# Altium project Shield.PrjPcb
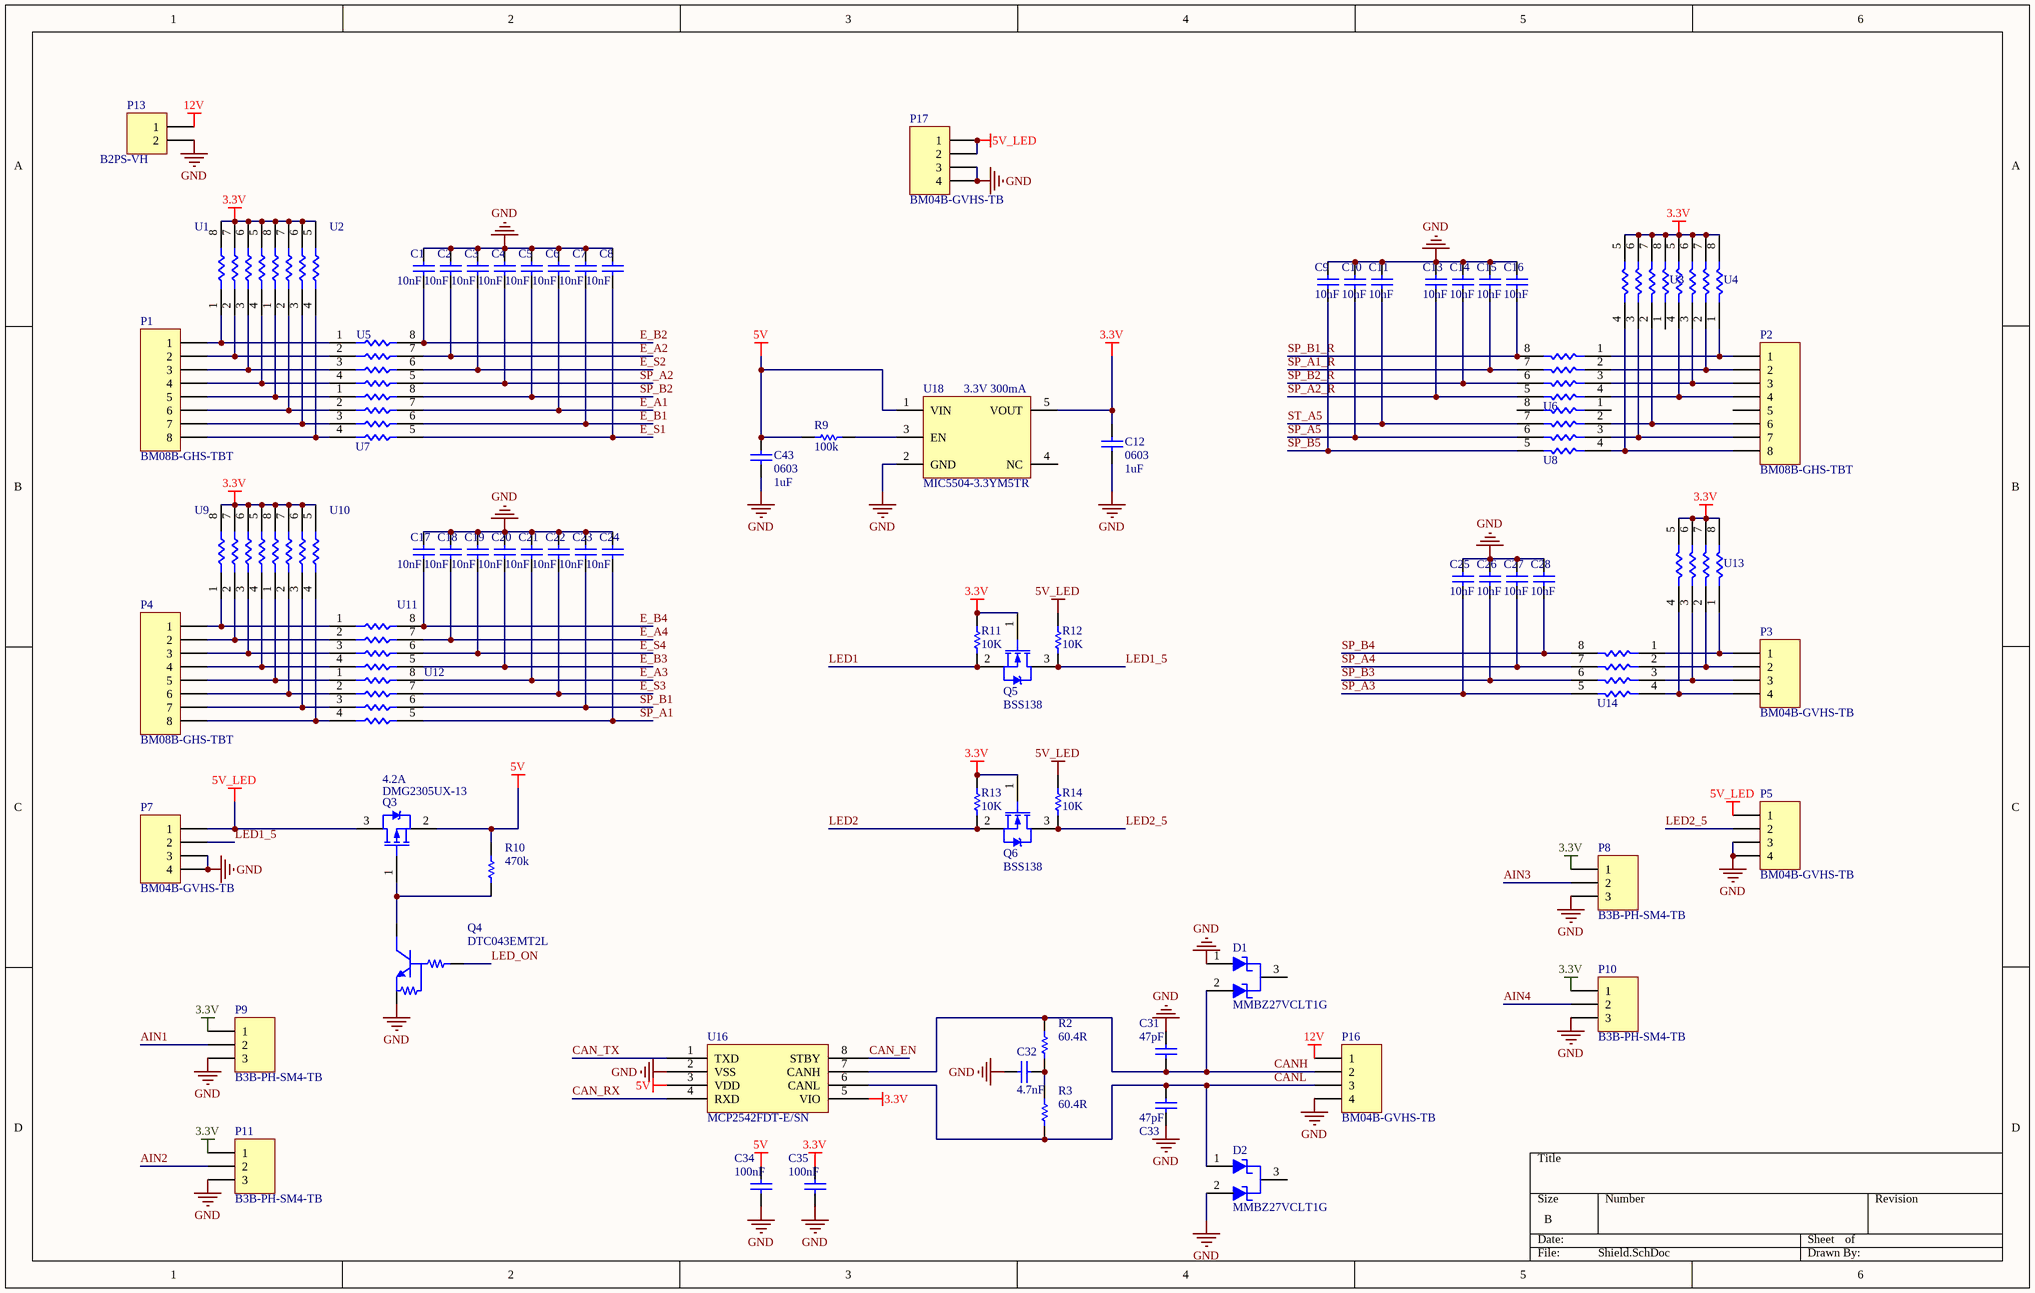
[diagram p0: Shield.SchDoc]
3 sheets, 103 parts. Net scope: global (net labels, ports and power ports of the same name join across sheets).
Board file: Shield.PcbDoc
Sheets:
  Shield.SchDoc
  SheildLattePanda.SchDoc
  STM32F103RCT6.SchDoc

## Sheet Shield.SchDoc
size B; SheetNumber: 1; SheetTotal: 3

### Parts
C1  10nF  [C0402]
C2  10nF  [C0402]
C3  10nF  [C0402]
C4  10nF  [C0402]
C5  10nF  [C0402]
C6  10nF  [C0402]
C7  10nF  [C0402]
C8  10nF  [C0402]
C9  10nF  [C0402]
C10  10nF  [C0402]
C11  10nF  [C0402]
C12  0603  value 1uF  [C0603]
C13  10nF  [C0402]
C14  10nF  [C0402]
C15  10nF  [C0402]
C16  10nF  [C0402]
C17  10nF  [C0402]
C18  10nF  [C0402]
C19  10nF  [C0402]
C20  10nF  [C0402]
C21  10nF  [C0402]
C22  10nF  [C0402]
C23  10nF  [C0402]
C24  10nF  [C0402]
C25  10nF  [C0402]
C26  10nF  [C0402]
C27  10nF  [C0402]
C28  10nF  [C0402]
C31  47pF  [C0402]
C32  4.7nF  [C0402]
C33  47pF  [C0402]
C34  100nF  [C0402]
C35  100nF  [C0402]
C43  0603  value 1uF  [C0603]
D1  MMBZ27VCLT1G  [SOT-23]
D2  MMBZ27VCLT1G  [SOT-23]
P1  BM08B-GHS-TBT  [CONN-BM08B-GHS-TBT]
P2  BM08B-GHS-TBT  [CONN-BM08B-GHS-TBT - INVERTED]
P3  BM04B-GVHS-TB  [CONN-SM04B-GHSV-TB - INVERTED]
P4  BM08B-GHS-TBT  [CONN-BM08B-GHS-TBT]
P5  BM04B-GVHS-TB  [CONN-SM04B-GHSV-TB - INVERTED]
P7  BM04B-GVHS-TB  [CONN-SM04B-GHSV-TB]
P8  B3B-PH-SM4-TB  [CONN-B3B-PH-SM4-TB]
P9  B3B-PH-SM4-TB  [CONN-B3B-PH-SM4-TB]
P10  B3B-PH-SM4-TB  [CONN-B3B-PH-SM4-TB]
P11  B3B-PH-SM4-TB  [CONN-B3B-PH-SM4-TB]
P13  B2PS-VH  [CONN-B2PS-VH]
P16  BM04B-GVHS-TB  [CONN-SM04B-GHSV-TB - INVERTED]
P17  BM04B-GVHS-TB  [CONN-SM04B-GHSV-TB - INVERTED]
Q3  DMG2305UX-13  Continuous Drain Current (ID): 4.2A  [SOT23-3]
Q4  DTC043EMT2L  [SOT-723]
Q5  BSS138  [SOT-23]
Q6  BSS138  [SOT-23]
R2  60.4R  [R0402]
R3  60.4R  [R0402]
R9  value 100k  [R0402]
R10  value 470k  [R0402]
R11  value 10K  [R0402]  (hidden comment: Res1)
R12  value 10K  [R0402]  (hidden comment: Res1)
R13  value 10K  [R0402]  (hidden comment: Res1)
R14  value 10K  [R0402]  (hidden comment: Res1)
U1  CAY16-1002F4LF  [RES_ARRAY_4]  (value not drawn)
U2  CAY16-1002F4LF  [RES_ARRAY_4]  (value not drawn)
U3  CAY16-1002F4LF  [RES_ARRAY_4 - INVERTED]  (value not drawn)
U4  CAY16-1002F4LF  [RES_ARRAY_4 - INVERTED]  (value not drawn)
U5  CAY16-1002F4LF  [RES_ARRAY_4 - INVERTED]  (value not drawn)
U6  CAY16-1002F4LF  [RES_ARRAY_4]  (value not drawn)
U7  CAY16-1002F4LF  [RES_ARRAY_4 - INVERTED]  (value not drawn)
U8  CAY16-1002F4LF  [RES_ARRAY_4]  (value not drawn)
U9  CAY16-1002F4LF  [RES_ARRAY_4]  (value not drawn)
U10  CAY16-1002F4LF  [RES_ARRAY_4]  (value not drawn)
U11  CAY16-1002F4LF  [RES_ARRAY_4 - INVERTED]  (value not drawn)
U12  CAY16-1002F4LF  [RES_ARRAY_4 - INVERTED]  (value not drawn)
U13  CAY16-1002F4LF  [RES_ARRAY_4]  (value not drawn)
U14  CAY16-1002F4LF  [RES_ARRAY_4]  (value not drawn)
U16  MCP2542FDT-E/SN  [SOIC-8(150MIL)]
U18  MIC5504-3.3YM5TR  value 3.3V 300mA  [SOT23-5]

### Nets
3.3V: C12.2 C35.2 P8.1 P9.1 P10.1 P11.1 Q5.1(G) Q6.1(G) R11.1 R13.1 U1.5 U1.6 U1.7 U1.8 U2.5 U2.6 U2.7 U2.8 U3.5 U3.6 U3.7 U3.8 U4.5 U4.6 U4.7 U4.8 U9.5 U9.6 U9.7 U9.8 U10.5 U10.6 U10.7 U10.8 U13.5 U13.6 U13.7 U13.8 U16.5(VIO) U18.5(VOUT)
5V: C34.2 C43.2 Q3.2(S) R9.1 R10.2 U16.3(VDD) U18.1(VIN)
5V_LED: P5.1 P7.1 P17.1 P17.2 Q3.3(D) R12.1 R14.1
12V: P13.1 P16.1
GND: C1.2 C2.2 C3.2 C4.2 C5.2 C6.2 C7.2 C8.2 C9.2 C10.2 C11.2 C12.1 C13.2 C14.2 C15.2 C16.2 C17.2 C18.2 C19.2 C20.2 C21.2 C22.2 C23.2 C24.2 C25.2 C26.2 C27.2 C28.2 C31.2 C32.2 C33.1 C34.1 C35.1 C43.1 D1.1 D2.2(C) P5.3 P5.4 P7.3 P7.4 P8.3 P9.3 P10.3 P11.3 P13.2 P16.4 P17.3 P17.4 Q4.2(E) U16.2(VSS) U18.2(GND)
AIN1: P9.2
AIN2: P11.2
AIN3: P8.2
AIN4: P10.2
CAN_EN: U16.8(STBY)
CAN_RX: U16.4(RXD)
CAN_TX: U16.1(TXD)
CANH: C31.1 D1.2(C) P16.2 R2.2 U16.7(CANH)
CANL: C33.2 D2.1 P16.3 R3.1 U16.6(CANL)
E_A1: C6.1 U7.7
E_A2: C2.1 U5.7
E_A3: C21.1 U12.8
E_A4: C18.1 U11.7
E_B1: C7.1 U7.6
E_B2: C1.1 U5.8
E_B3: C20.1 U11.5
E_B4: C17.1 U11.8
E_S1: C8.1 U7.5
E_S2: C3.1 U5.6
E_S3: C22.1 U12.7
E_S4: C19.1 U11.6
LED1: Q5.2(S) R11.2
LED1_5: P7.2 Q5.3(D) R12.2
LED2: Q6.2(S) R13.2
LED2_5: P5.2 Q6.3(D) R14.2
LED_ON: Q4.1(B)
SP_A1: C24.1 U12.5
SP_A1_R: C15.1 U6.7
SP_A2: C4.1 U5.5
SP_A2_R: C13.1 U6.5
SP_A3: C25.1 U14.5
SP_A4: C27.1 U14.7
SP_A5: C10.1 U8.6
SP_B1: C23.1 U12.6
SP_B1_R: C16.1 U6.8
SP_B2: C5.1 U7.8
SP_B2_R: C14.1 U6.6
SP_B3: C26.1 U14.6
SP_B4: C28.1 U14.8
SP_B5: C9.1 U8.5
ST_A5: C11.1 U8.7
NetC32_1: C32.1 R2.1 R3.2
NetP1_1: P1.1 U1.1 U5.1
NetP1_2: P1.2 U1.2 U5.2
NetP1_3: P1.3 U1.3 U5.3
NetP1_4: P1.4 U1.4 U5.4
NetP1_5: P1.5 U2.1 U7.1
NetP1_6: P1.6 U2.2 U7.2
NetP1_7: P1.7 U2.3 U7.3
NetP1_8: P1.8 U2.4 U7.4
NetP2_1: P2.1 U4.1 U6.1
NetP2_2: P2.2 U4.2 U6.2
NetP2_3: P2.3 U4.3 U6.3
NetP2_4: P2.4 U4.4 U6.4
NetP2_6: P2.6 U3.2 U8.2
NetP2_7: P2.7 U3.3 U8.3
NetP2_8: P2.8 U3.4 U8.4
NetP3_1: P3.1 U13.1 U14.1
NetP3_2: P3.2 U13.2 U14.2
NetP3_3: P3.3 U13.3 U14.3
NetP3_4: P3.4 U13.4 U14.4
NetP4_1: P4.1 U9.1 U11.1
NetP4_2: P4.2 U9.2 U11.2
NetP4_3: P4.3 U9.3 U11.3
NetP4_4: P4.4 U9.4 U11.4
NetP4_5: P4.5 U10.1 U12.1
NetP4_6: P4.6 U10.2 U12.2
NetP4_7: P4.7 U10.3 U12.3
NetP4_8: P4.8 U10.4 U12.4
NetQ3_1: Q3.1(G) Q4.3(C) R10.1
NetR9_2: R9.2 U18.3(EN)

Not connected (* = marked no-connect by the designer): D1 3(K); D2 3(K); P2 5; U3 1; U8 1 8; U18 4(NC)

### Library data of the parts
C1-C11 C13-C28 = Cap: Multilayer Ceramic Capacitor, 0.01 uF, 16 V, ± 5%, C0G (NP0), 0402 [1005 Metric]; Manufacturer: Yageo; Manufacturer Part Number: CC0402KRX7R7BB103; Voltage Rating: 16V; Tolerance: 10%; Dielectric: X7R; Insulation Resistance: 10GR; Dissipation Factor: 3.5%; Supplier 1: Digi-Key; Supplier Part Number 1: 311-1042-1-ND; RoHS: Yes; Category: Ceramic Capacitors; Stock 1: 2573957; Pricing 1: 1=0.1, 10=0.016, 50=0.0088, 100=0.0071, 500=0.0051, 1000=0.004, 2500=0.00364, 5000=0.00335 (USD); Mount: Surface Mount; Case/Package: 0402; Number of Pins: 2; Case Code (Metric): 1005; Case Code (Imperial): 0402; Min Operating Temperature: -55°C; Max Operating Temperature: 125°C; Capacitance: 10nF; Packaging: Tape and Reel; Series: CC; Voltage Rating (DC): 16V; Termination: SMD/SMT; Package Quantity: 1; Length: 1mm; Width: 0.02inch; Height: 0.5mm; Depth: 0.5mm; Thickness: 0.022inch; Radiation Hardening: No; RoHS Compliant: Yes; Reach SVHC Compliant: No; Lead Free: Lead Free; Halogen Free: Halogen Free; ComponentLink1URL: https://datasheet.ciiva.com/143/mlccorderingcode-143951.pdf?src-supplier=Digi-Key; ComponentLink1Description: https://datasheet.ciiva.com/143/mlccorderingcode-143951.pdf?src-supplier=Digi-Key; ComponentLink2URL: https://datasheet.ciiva.com/143/mlccorderingcode-143950.pdf?src-supplier=Digi-Key; ComponentLink2Description: https://datasheet.ciiva.com/143/mlccorderingcode-143950.pdf?src-supplier=Digi-Key; ComponentLink3URL: https://datasheet.ciiva.com/143/upy-gphc-x7r-6-3v-to-50v-8-143952.pdf?src-supplier=Digi-Key; ComponentLink3Description: https://datasheet.ciiva.com/143/upy-gphc-x7r-6-3v-to-50v-8-143952.pdf?src-supplier=Digi-Key; ComponentLink4URL: https://datasheet.ciiva.com/8033/70765-8033655.pdf?src-supplier=Element14; ComponentLink4Description: https://datasheet.ciiva.com/8033/70765-8033655.pdf?src-supplier=Element14; ComponentLink5URL: https://datasheet.ciiva.com/7978/1489800-7978109.pdf?src-supplier=Element14; ComponentLink5Description: https://datasheet.ciiva.com/7978/1489800-7978109.pdf?src-supplier=Element14; ComponentLink6URL: https://datasheet.ciiva.com/28450/1489800-28450330.pdf?src-supplier=Element14; ComponentLink6Description: https://datasheet.ciiva.com/28450/1489800-28450330.pdf?src-supplier=Element14; ComponentLink7URL: https://datasheet.ciiva.com/8033/1489800-8033659.pdf?src-supplier=Element14; ComponentLink7Description: https://datasheet.ciiva.com/8033/1489800-8033659.pdf?src-supplier=Element14; ComponentLink8URL: https://datasheet.ciiva.com/8033/1489800-8033658.pdf?src-supplier=Element14; ComponentLink8Description: https://datasheet.ciiva.com/8033/1489800-8033658.pdf?src-supplier=Element14; ComponentLink9URL: https://datasheet.ciiva.com/5425/upy-gp-np0-16v-to-50v-8-3714-5425438.pdf?src-supplier=Mouser; ComponentLink9Description: https://datasheet.ciiva.com/5425/upy-gp-np0-16v-to-50v-8-3714-5425438.pdf?src-supplier=Mouser
C12 C43 = Cap: Capacitor; Published: 8-Jun-2000; LatestRevisionDate: 17-Jul-2002; LatestRevisionNote: Re-released for DXP Platform.; PackageReference: RAD-0.3; Publisher: Altium Limited; PackageDescription: Radial Cap, Thru-Hole; 2 Leads; 0.3 in Pin Spacing
C31 C33 = Cap: Cap Cer 47PF 100V C0G/NP0 0402; Manufacturer: Wurth Electronics; Manufacturer Part Number: 885012005078; Tolerance: 5%; Supplier 1: Digi-Key; Supplier Part Number 1: 732-12071-1-ND; RoHS: Yes; Category: Ceramic Capacitors; Stock 1: 57686; Pricing 1: 1=0.1, 10=0.039, 100=0.035, 500=0.031 (USD); Mount: Surface Mount; Case/Package: 0402; Case Code (Imperial): 0402; Case Code (Metric): 1005; Min Operating Temperature: -55°C; Max Operating Temperature: 125°C; Packaging: Cut Tape; Capacitance: 47pF; Series: WCAP-CSGP; Voltage Rating: 100V; ComponentLink1URL: http://www.farnell.com/datasheets/2546566.pdf?src-supplier=Farnell; ComponentLink1Description: http://www.farnell.com/datasheets/2546566.pdf?src-supplier=Farnell; ComponentLink2URL: https://katalog.we-online.de/pbs/datasheet/885012005078.pdf?src-supplier=Digi-Key; ComponentLink2Description: https://katalog.we-online.de/pbs/datasheet/885012005078.pdf?src-supplier=Digi-Key; ComponentLink3URL: http://www.farnell.com/datasheets/2546566.pdf?src-supplier=Newark; ComponentLink3Description: http://www.farnell.com/datasheets/2546566.pdf?src-supplier=Newark
C32 = Cap: Cap Cer 4700PF 100V X7R 0402; Manufacturer: Wurth Electronics; Manufacturer Part Number: 885012205084; Tolerance: 10%; Supplier 1: Digi-Key; Supplier Part Number 1: 732-12234-1-ND; RoHS: No; Category: Ceramic Capacitors; Stock 1: 14393; Pricing 1: 1=0.1, 10=0.039, 100=0.035, 500=0.031 (USD); Mount: Surface Mount; Case/Package: 0402; Case Code (Imperial): 0402; Case Code (Metric): 1005; Min Operating Temperature: -55°C; Max Operating Temperature: 125°C; Packaging: Cut Tape; Capacitance: 4.7nF; Series: WCAP-CSGP; Voltage Rating: 100V; ComponentLink1URL: http://www.farnell.com/datasheets/2546792.pdf?src-supplier=Farnell; ComponentLink1Description: http://www.farnell.com/datasheets/2546792.pdf?src-supplier=Farnell; ComponentLink2URL: https://katalog.we-online.de/pbs/datasheet/885012205084.pdf?src-supplier=Digi-Key; ComponentLink2Description: https://katalog.we-online.de/pbs/datasheet/885012205084.pdf?src-supplier=Digi-Key; ComponentLink3URL: http://www.farnell.com/datasheets/2546792.pdf?src-supplier=Newark; ComponentLink3Description: http://www.farnell.com/datasheets/2546792.pdf?src-supplier=Newark; ComponentLink4URL: http://www.farnell.com/datasheets/2546792.pdf?src-supplier=Element14; ComponentLink4Description: http://www.farnell.com/datasheets/2546792.pdf?src-supplier=Element14
C34 C35 = Cap: 100nF ±10% 16V X7R 0402 Multilayer Ceramic Capacitors MLCC - SMD/SMT RoHS; Manufacturer: KEMET; Manufacturer Part Number: C0402C104K4RAC-TU; Dissipation Factor: 3.5%; Supplier 1: Digi-Key; Supplier Part Number 1: 399-C0402C104K4RAC7867CT-ND; RoHS: Yes; Category: Ceramic Capacitors; Stock 1: 4665619; Pricing 1: 1=0.1, 10=0.032, 50=0.0172, 100=0.0141, 500=0.01008, 1000=0.00792, 2500=0.0072, 5000=0.00662 (USD); Case/Package: 0402; Number of Pins: 2; Case Code (Metric): 1005; Case Code (Imperial): 0402; Dielectric Material: Ceramic; Min Operating Temperature: -55°C; Max Operating Temperature: 125°C; Capacitance: 100nF; Tolerance: 10%; Voltage Rating: 16V; Packaging: Tape and Reel; Series: C; Dielectric: X7R; Voltage: 16V; Termination: SMD/SMT; Length: 1mm; Height: 0.5mm; Depth: 0.5mm; Reach SVHC Compliant: No
D1 D2 = MMBZ27VCLT1G: TVS DIODE 22VWM 38VC SOT23; Manufacturer: ON Semiconductor; Direction: Unidirectional,Bidirectional; Number of Elements: 2; Reverse Breakdown Voltage: 25.65V; Operating Supply Voltage: 22V; Max Surge Current: 1A; Polarity: Unidirectional; Clamping Voltage: 38V; Peak Pulse Power: 40W; Power Line Protection: No; Leakage Current: 50nA; Test Current: 1mA; ESD Protection: Yes; Diode Type: ZENER; Max Breakdown Voltage: 28.35V; Voltage Rating (DC): 27V; Supplier 1: Digi-Key; Supplier Part Number 1: MMBZ27VCLT1GOSCT-ND; Manufacturer Part Number: MMBZ27VCLT1G; RoHS: Yes; Category: Zener Diodes; Stock 1: 25970; Pricing 1: 1=0.2, 10=0.14, 100=0.0684, 500=0.05708, 1000=0.03966 (USD); Case/Package: SOT-23-3; Number of Pins: 3; Min Operating Temperature: -55°C; Max Operating Temperature: 150°C; Package Quantity: 3000; Packaging: Tape and Reel; Number of Channels: 2; Breakdown Voltage: 25.65V; Termination: SMD/SMT; Number of Unidirectional Channels: 2; Reverse Standoff Voltage: 22V; Min Breakdown Voltage: 25.65V; Working Voltage: 22V; Peak Pulse Current: 1A; Max Reverse Leakage Current: 50nA; Series: -; Power Dissipation: 40W; Clamping Voltage-Max: 38V; Length: 2.9mm; Width: 1.3mm; Height: 0.94mm; Depth: 1.3mm; Radiation Hardening: No; Reach SVHC Compliant: No; Lead Free: Lead Free; RoHS Compliant: Yes; ComponentLink1URL: https://datasheet.ciiva.com/34303/2011918-34303829.pdf?src-supplier=Jameco; ComponentLink1Description: https://datasheet.ciiva.com/34303/2011918-34303829.pdf?src-supplier=Jameco; ComponentLink2URL: https://datasheet.ciiva.com/18426/70099539-18426859.pdf?src-supplier=Allied+Electronics; ComponentLink2Description: https://datasheet.ciiva.com/18426/70099539-18426859.pdf?src-supplier=Allied+Electronics
P1 P2 P4 = Header 8: Header, 8-Pin; Manufacturer: JST; Supplier 1: Digi-Key; Supplier Part Number 1: 455-BM08B-GHS-TBTCT-ND; Manufacturer Part Number: BM08B-GHS-TBT; RoHS: No; Stock 1: 108322; Pricing 1: 1=0.59, 10=0.512, 100=0.422, 500=0.367, 1000=0.30277 (USD)
P3 P5 P7 P16 P17 = Header 4: Conn Header SMD 4POS 1.25MM; Manufacturer: JST; Supplier 1: DigiKey; Supplier Part Number 1: 455-BM04B-GVHS-TBCT-ND; Manufacturer Part Number: BM04B-GVHS-TB; Stock 1: 920; Pricing 1: 1=0.5, 10=0.422, 100=0.3284, 500=0.2815, 1000=0.23458 (USD)
P8-P11 = Header 3: Header B3B-PH-SM4-TB, 2.00mm, 3-contacts, top entry, SMT /1000/reel; Manufacturer: JST; Supplier 1: Digi-Key; Supplier Part Number 1: 455-B3B-PH-SM4-TBCT-ND; Manufacturer Part Number: B3B-PH-SM4-TB; RoHS: No; Stock 1: 75711; Pricing 1: 1=0.62, 10=0.541, 100=0.4459, 500=0.38772 (USD); Orientation: Vertical
P13 = Header 2: Header B2PS-VH, 3.96mm, 2-contacts, side entry, THT/1000/box; Manufacturer: JST; Number of Positions: 2; Gender: Male; Pitch: 0.156inch; Supplier 1: Digi-Key; Supplier Part Number 1: 455-B2PS-VH-ND; Manufacturer Part Number: B2PS-VH; RoHS: Yes; Category: Connectors; Stock 1: 60240; Pricing 1: 1=0.25, 10=0.209, 100=0.1612, 500=0.13636, 1000=0.11157, 5000=0.09917, 10000=0.08987 (USD); Mount: Through Hole; Color: Natural; Contact Plating: Tin,Lead; Housing Color: Natural; Contact Material: Brass; Housing Material: Nylon; Fastening Type: Ramp; Packaging: Bulk; Package Quantity: 1000; Number of Rows: 1; Termination: Solder; Orientation: Horizontal; Number of Contacts: 2; Series: VH; Contact Type: Male Pin; Contact Mating Length: 0.303inch; Lead Free: Contains Lead; ComponentLink1URL: https://datasheet.ciiva.com/6905/vhseries-6905894.pdf?src-supplier=Digi-Key; ComponentLink1Description: https://datasheet.ciiva.com/6905/vhseries-6905894.pdf?src-supplier=Digi-Key
Q3 = ZXMP10A13FTA: MOSFET P-CH 20V 4.2A SOT23; Manufacturer: Diodes; Rise Time: 13.7ns; Rds On Max: 52mR; Input Capacitance: 808pF; Max Power Dissipation: 1.4W; Turn-On Delay Time: 10.8ns; Turn-Off Delay Time: 79.3ns; Fall Time: 34.7ns; Threshold Voltage: -900mV; Element Configuration: Single; Gate to Source Voltage (Vgs): 8V; Number of Channels: 1; Drain to Source Breakdown Voltage: -20V; On-State Resistance: 65MR; Supplier 1: Digi-Key; Supplier Part Number 1: DMG2305UX-13DICT-ND; Manufacturer Part Number: DMG2305UX-13; Stock 1: 562398; Pricing 1: 1=0.38, 10=0.348, 100=0.1948, 500=0.1044, 1000=0.071 (EUR); Mount: Surface Mount; Case/Package: SOT-23; Number of Pins: 3; Weight: 0.000282oz; Min Operating Temperature: -55°C; Max Operating Temperature: 150°C; Package Quantity: 1; Packaging: Tape and Reel; Drain to Source Voltage (Vdss): 20V; Drain to Source Resistance: 52mR; Length: 3mm; Height: 1.1mm; Width: 1.4mm; Radiation Hardening: No; REACH SVHC: No SVHC; Lead Free: Lead Free; ComponentLink1URL: http://www.diodes.com/datasheets/DMG2305UX.pdf; ComponentLink1Description: http://www.diodes.com/datasheets/DMG2305UX.pdf; ComponentLink2URL: https://www.diodes.com/assets/Datasheets/DMG2305UX.pdf; ComponentLink2Description: https://www.diodes.com/assets/Datasheets/DMG2305UX.pdf
Q4 = DTC043EMT2L: TRANS PREBIAS NPN 50V VMT3; Manufacturer: Rohm; Max Collector Current: 100mA; Collector Emitter Voltage (VCEO): 150mV; Transition Frequency: 250MHz; Max Power Dissipation: 150mW; Element Configuration: Single; Output Voltage: 50mV; Supplier 1: Digi-Key; Manufacturer Part Number: DTC043EMT2L; Stock 1: 216; Pricing 1: 1=0.2, 10=0.166, 25=0.1392, 100=0.0881, 250=0.068, 500=0.0579, 1000=0.0394, 2500=0.0355 (USD); Mount: Surface Mount; Case/Package: SOT-723; Number of Pins: 3; Max Operating Temperature: 150°C; Packaging: Tape and Reel; Collector Emitter Breakdown Voltage: 50V; Max Breakdown Voltage: 50V; Polarity: NPN; Max Frequency: 250MHz; Continuous Collector Current: 100mA; Package Quantity: 8000; Lead Free: Lead Free; ComponentLink1URL: http://www.mouser.com/ds/2/348/tc043eebtl-e-1019209.pdf?src-supplier=Mouser; ComponentLink1Description: http://www.mouser.com/ds/2/348/tc043eebtl-e-1019209.pdf?src-supplier=Mouser; ComponentLink2URL: http://rohmfs.rohm.com/en/techdata_basic/transistor/taping/VMT3_T2L_taping.pdf?src-supplier=Digi-Key; ComponentLink2Description: http://rohmfs.rohm.com/en/techdata_basic/transistor/taping/VMT3_T2L_taping.pdf?src-supplier=Digi-Key; ComponentLink3URL: http://rohmfs.rohm.com/en/products/databook/datasheet/discrete/transistor/digital/dtc043emt2l-e.pdf?src-supplier=Digi-Key; ComponentLink3Description: http://rohmfs.rohm.com/en/products/databook/datasheet/discrete/transistor/digital/dtc043emt2l-e.pdf?src-supplier=Digi-Key; ComponentLink4URL: http://rohmfs.rohm.com/en/products/databook/datasheet/discrete/transistor/digital/dtc043eb.pdf?src-supplier=Avnet; ComponentLink4Description: http://rohmfs.rohm.com/en/products/databook/datasheet/discrete/transistor/digital/dtc043eb.pdf?src-supplier=Avnet; Supplier Part Number 1: DTC043EMT2LCT-ND
Q5 Q6 = NMOS-2: N-Channel Power MOSFET; Manufacturer 1: Jiangsu Changjing Electronics; Supplier 1: JLCPCB; Supplier Part Number 1: C78284; Manufacturer Part Number 1: BSS138; Value: BSS138
R2 R3 = Res1: Res Thick Film 0402 60.4 Ohm 1% 1/16W ±100ppm/°C Molded SMD SMD Paper T/R; Manufacturer: Vishay; Manufacturer Part Number: CRCW040260R4FKED; Power Rating: 63mW; Voltage Rating: 50V; Supplier 1: Digi-Key; Supplier Part Number 1: 541-60.4LCT-ND; RoHS: Yes; Category: Chip SMD Resistors; Stock 1: 42527; Pricing 1: 1=0.1, 10=0.033, 50=0.0182, 100=0.0134, 500=0.00818, 1000=0.00602, 5000=0.00432 (USD); Case/Package: 0402; Case Code (Imperial): 0402; Case Code (Metric): 1005; Contact Plating: Tin; Size Code: 0402; Weight: 2.3E-05oz; Min Operating Temperature: -55°C; Max Operating Temperature: 155°C; Resistance: 60.4R; Packaging: Tape and Reel; Termination: SMD/SMT; Temperature Coefficient: 100ppm/°C; Series: CRCW; Tolerance: 1%; Number of Terminations: 2; Max Power Dissipation: 63mW; Package Quantity: 10; Voltage Rating (DC): 50V; Features: Automotive AEC-Q200; Resistor Type: Thick Film; Resistance Tolerance: 1%; Construction: Rectangular; Technology: THICK FILM; Length: 1mm; Width: 0.02inch; Height: 0.35mm; Depth: 0.5mm; Ratings: AEC-Q200; Radiation Hardening: No; RoHS Compliant: Yes; Lead Free: Lead Free; Reach SVHC Compliant: Unknown; Military Standard: Not; ComponentLink1URL: https://datasheet.ciiva.com/22705/1697337-22705528.pdf?src-supplier=Element14; ComponentLink1Description: https://datasheet.ciiva.com/22705/1697337-22705528.pdf?src-supplier=Element14; ComponentLink2URL: https://datasheet.ciiva.com/7690/1697337-7690687.pdf?src-supplier=Element14; ComponentLink2Description: https://datasheet.ciiva.com/7690/1697337-7690687.pdf?src-supplier=Element14; ComponentLink3URL: https://datasheet.ciiva.com/22868/70201119-22868795.pdf?src-supplier=Allied+Electronics; ComponentLink3Description: https://datasheet.ciiva.com/22868/70201119-22868795.pdf?src-supplier=Allied+Electronics; ComponentLink4URL: https://datasheet.ciiva.com/16772/70201119-16772855.pdf?src-supplier=Allied+Electronics; ComponentLink4Description: https://datasheet.ciiva.com/16772/70201119-16772855.pdf?src-supplier=Allied+Electronics; ComponentLink5URL: https://datasheet.ciiva.com/2463/dcrcwe3-2463466.pdf?src-supplier=Digi-Key; ComponentLink5Description: https://datasheet.ciiva.com/2463/dcrcwe3-2463466.pdf?src-supplier=Digi-Key; ComponentLink6URL: https://datasheet.ciiva.com/2463/dcrcwe3-2463467.pdf?src-supplier=Digi-Key; ComponentLink6Description: https://datasheet.ciiva.com/2463/dcrcwe3-2463467.pdf?src-supplier=Digi-Key; ComponentLink7URL: https://datasheet.ciiva.com/2463/dcrcwe3-2463468.pdf?src-supplier=Digi-Key; ComponentLink7Description: https://datasheet.ciiva.com/2463/dcrcwe3-2463468.pdf?src-supplier=Digi-Key; ComponentLink8URL: https://datasheet.ciiva.com/16395/dcrcwe3-16395727.pdf?src-supplier=Future+Electronics; ComponentLink8Description: https://datasheet.ciiva.com/16395/dcrcwe3-16395727.pdf?src-supplier=Future+Electronics
R9 R10 = Res1: Res Thick Film 0402 60.4 Ohm 1% 1/16W ±100ppm/°C Molded SMD SMD Paper T/R
R11-R14 = Res1: RES SMD 10 KOHM 1% 1/16W 0402; Manufacturer 1: UNI-ROYAL(Uniroyal Elec); Manufacturer Part Number 1: 0402WGF1002TCE; Footprint: 0402; Supplier 1: JLCPCB; Supplier Part Number 1: C25744
U1-U14 = ResArray4: Res Thick Film Array 10K Ohm 1% 0.25W(1/4W) ±200ppm/C ISOL 8-Pin 1206(4 X 0603) Convex SMD T/R; Manufacturer: Bourns; Resistance: 10kR; Power Rating: 248mW; Voltage Rating: 50V; Number of Elements: 4; Circuit Type: Isolated; Power Per Element: 62.5mW; Temperature Coefficient: 200ppm/°C; Supplier 1: Digi-Key; Supplier Part Number 1: CAY16-1002F4LFCT-ND; Manufacturer Part Number: CAY16-1002F4LF; RoHS: Yes; Category: Resistor Arrays; Stock 1: 99378; Pricing 1: 1=0.1, 10=0.087, 25=0.06, 50=0.0466, 100=0.0333, 250=0.026, 500=0.02066, 1000=0.01467 (USD); Mount: Surface Mount; Case/Package: 1206; Number of Pins: 8; Case Code (Metric): 3216; Case Code (Imperial): 1206; Min Operating Temperature: -55°C; Max Operating Temperature: 125°C; Tolerance: 1%; Packaging: Tape and Reel; Package Quantity: 1; Number of Resistors: 4; Termination: Convex; Voltage Rating (DC): 50V; Number of Circuits: 4; Series: CAY16; Technology: THICK FILM; Resistance Tolerance: 1%; Length: 3.2mm; Width: 0.063inch; Height: 0.024inch; Terminal Pitch: 0.8mm; Depth: 1.6mm; Radiation Hardening: No; Reach SVHC Compliant: No; Military Standard: Not; RoHS Compliant: Yes; ComponentLink1URL: https://datasheet.ciiva.com/36526/1979652-36526231.pdf?src-supplier=Jameco; ComponentLink1Description: https://datasheet.ciiva.com/36526/1979652-36526231.pdf?src-supplier=Jameco; ComponentLink2URL: https://datasheet.ciiva.com/11807/0900766b8064e462-11807542.pdf?src-supplier=Rs; ComponentLink2Description: https://datasheet.ciiva.com/11807/0900766b8064e462-11807542.pdf?src-supplier=Rs; ComponentLink3URL: https://datasheet.ciiva.com/1478/1849489-1478833.pdf?src-supplier=Element14; ComponentLink3Description: https://datasheet.ciiva.com/1478/1849489-1478833.pdf?src-supplier=Element14; ComponentLink4URL: https://datasheet.ciiva.com/1478/1849489-1478834.pdf?src-supplier=Element14; ComponentLink4Description: https://datasheet.ciiva.com/1478/1849489-1478834.pdf?src-supplier=Element14; ComponentLink5URL: https://datasheet.ciiva.com/3264/catcay-3264846.pdf?src-supplier=Avnet; ComponentLink5Description: https://datasheet.ciiva.com/3264/catcay-3264846.pdf?src-supplier=Avnet; ComponentLink6URL: https://datasheet.ciiva.com/15157/getdatasheetpartid-150711-15157709.pdf?src-supplier=Verical; ComponentLink6Description: https://datasheet.ciiva.com/15157/getdatasheetpartid-150711-15157709.pdf?src-supplier=Verical; ComponentLink7URL: https://datasheet.ciiva.com/41449/001055372-da-01-en-wid-arr-cay16-1002f4lf-10k-ohm-4-w-1206-41449959.pdf?src-supplier=Conrad; ComponentLink7Description: https://datasheet.ciiva.com/41449/001055372-da-01-en-wid-arr-cay16-1002f4lf-10k-ohm-4-w-1206-41449959.pdf?src-supplier=Conrad
U16 = MCP2542FDT-E/SN: Can Interface IC Can Fd Transceiver - 8SOIC T/r; Manufacturer: Microchip; Data Rate: 8Mbps; Receiver Hysteresis: 200mV; Supplier 1: Digi-Key; Supplier Part Number 1: MCP2542FDT-E/SNCT-ND; Manufacturer Part Number: MCP2542FDT-E/SN; RoHS: Yes; Category: Interface ICs; Stock 1: 5854; Pricing 1: 1=1.03, 25=0.86, 100=0.79 (USD); Mount: Surface Mount; Case/Package: SOIC; Min Operating Temperature: -40°C; Max Operating Temperature: 125°C; Packaging: Rail/Tube; Series: -; RoHS Compliant: Yes; ComponentLink1URL: http://www.microchip.com/mymicrochip/filehandler.aspx?ddocname=en585412&src-supplier=Digi-Key; ComponentLink1Description: http://www.microchip.com/mymicrochip/filehandler.aspx?ddocname=en585412&src-supplier=Digi-Key; ComponentLink2URL: https://datasheet.octopart.com/MCP2542FDT-E-SN-Microchip-datasheet-98403628.pdf?src-supplier=SHENGYU+ELECTRONICS; ComponentLink2Description: https://datasheet.octopart.com/MCP2542FDT-E-SN-Microchip-datasheet-98403628.pdf?src-supplier=SHENGYU+ELECTRONICS
U18 = MIC5504-3.3YM5TR: IC REG LINEAR 3.3V 300MA SOT23-5; Manufacturer: Microchip Micrel; Min Input Voltage: 2.5V; Max Input Voltage: 5.5V; Dropout Voltage: 380mV; Number of Outputs: 1; Quiescent Current: 38uA; Accuracy: 3%; Operating Supply Current: 42uA; Power Supply Rejection Ratio (PSRR): 60dB; ComponentLink1URL: http://www.diodes.com/_files/datasheets/AP2204.pdf; ComponentLink1Description: http://www.diodes.com/_files/datasheets/AP2204.pdf; Supplier 1: Digi-Key; Manufacturer Part Number: MIC5504-3.3YM5TR; Stock 1: 128319; Pricing 1: 1=0.11, 25=0.0928 (USD); Mount: Surface Mount; Case/Package: SOT-23-5; Number of Pins: 5; Min Operating Temperature: -40°C; Max Operating Temperature: 125°C; Output Current: 300mA; Nominal Output Voltage: 3.3V; Packaging: Tape and Reel; Output Voltage: 3.3V; Max Output Current: 300mA; Length: 2.9mm; Height: 1.1mm; Width: 1.6mm; REACH SVHC: No SVHC; ComponentLink2URL: https://datasheet.ciiva.com/46425/1856860-46425639.pdf; ComponentLink2Description: https://datasheet.ciiva.com/46425/1856860-46425639.pdf; Supplier Part Number 1: 576-4764-1-ND

## Sheet SheildLattePanda.SchDoc
size A; SheetNumber: 2; SheetTotal: 3
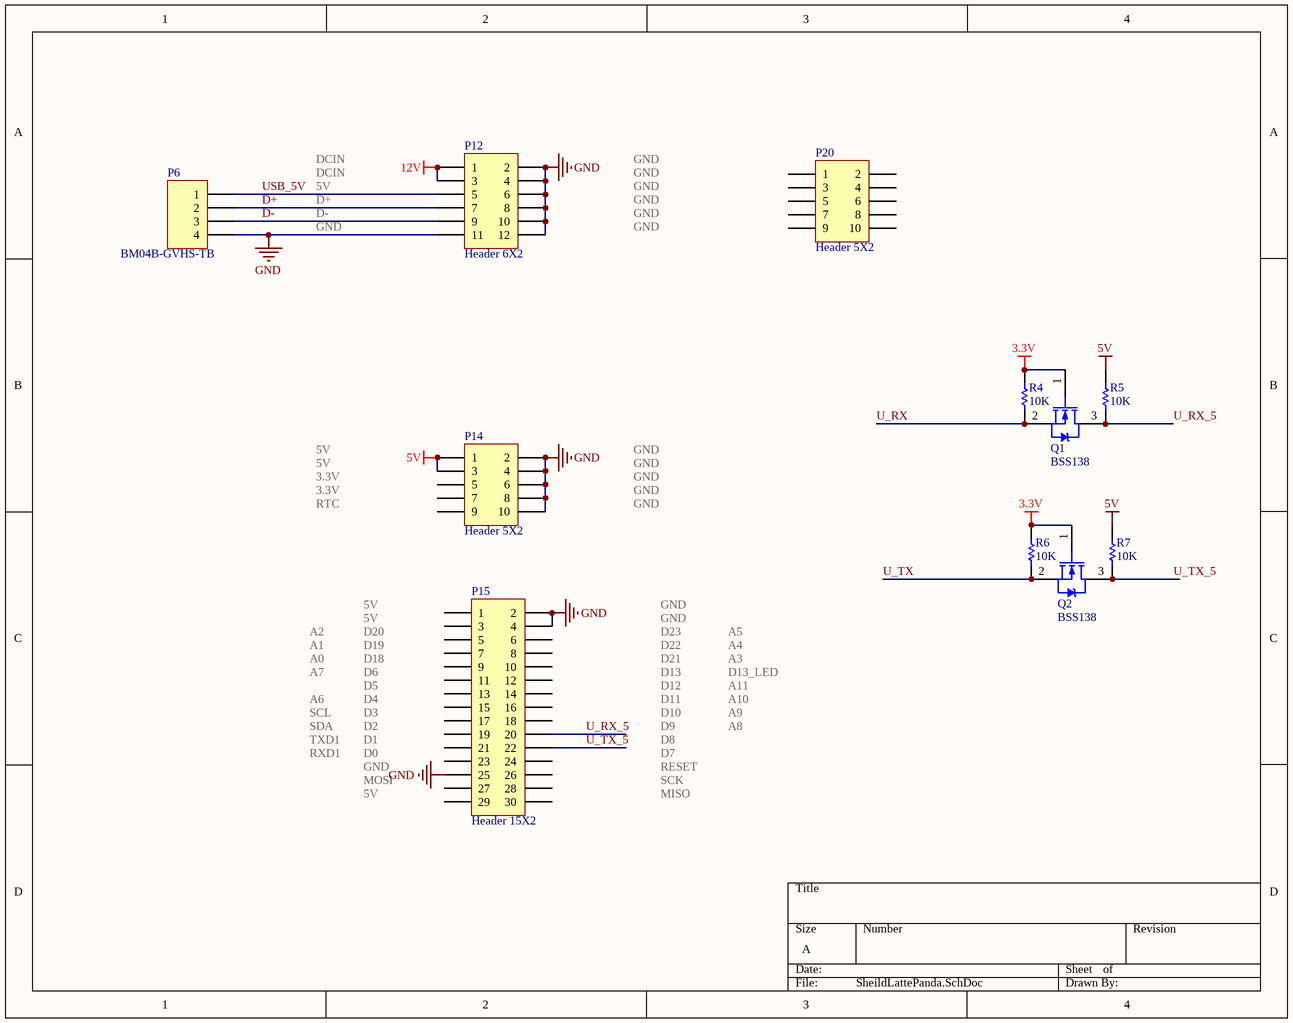
[diagram p1: SheildLattePanda.SchDoc]

### Parts
P6  BM04B-GVHS-TB  [CONN-SM04B-GHSV-TB - INVERTED]
P12  Header 6X2  [CONN-2x6_0_1INCH_SMT - duplicate - duplicate]
P14  Header 5X2  [CONN-2x5_0_1INCH_SMT - duplicate]
P15  Header 15X2  [CONN-2x15_0_1INCH_SMT]
P20  Header 5X2  [CONN-2x5_0_1INCH_SMT - duplicate]
Q1  BSS138  [SOT-23]
Q2  BSS138  [SOT-23]
R4  value 10K  [R0402]  (hidden comment: Res1)
R5  value 10K  [R0402]  (hidden comment: Res1)
R6  value 10K  [R0402]  (hidden comment: Res1)
R7  value 10K  [R0402]  (hidden comment: Res1)

### Nets
3.3V: Q1.1(G) Q2.1(G) R4.1 R6.1
5V: P14.1 P14.3 R5.1 R7.1
12V: P12.1 P12.3
GND: P6.4 P12.2 P12.4 P12.6 P12.8 P12.10 P12.11 P12.12 P14.2 P14.4 P14.6 P14.8 P14.10 P15.2 P15.4 P15.25
D+: P6.2 P12.7
D-: P6.3 P12.9
U_RX: Q1.2(S) R4.2
U_RX_5: P15.20 Q1.3(D) R5.2
U_TX: Q2.2(S) R6.2
U_TX_5: P15.22 Q2.3(D) R7.2
USB_5V: P6.1 P12.5

Not connected (* = marked no-connect by the designer): P14 5 7 9; P15 1 3 5 6 7 8 9 10 11 12 13 14 15 16 17 18 19 21 23 24 26 27 28 29 30; P20 1 2 3 4 5 6 7 8 9 10

### Notes on the sheet
- DCIN
- GND
- 5V
- D+
- D-
- 3.3V
- RTC
- A2
- D20
- D23
- A5
- A1
- A0
- A7
- A6
- D19
- D18
- D6
- D5
- D4
- D22
- D21
- D13
- D12
- D11
- A4
- A3
- D13_LED
- A11
- A10
- SCL
- SDA
- TXD1
- RXD1
- D3
- D2
- D1
- D0
- D10
- D9
- D8
- D7
- RESET
- A9
- A8
- MOSI
- SCK
- MISO

### Library data of the parts
P6 = Header 4: as P3 on sheet Shield; Supplier 1: DigiKey; Supplier Part Number 1: 455-BM04B-GVHS-TBCT-ND; Manufacturer Part Number: BM04B-GVHS-TB; Stock 1: 920; Pricing 1: 1=0.5, 10=0.422, 100=0.3284, 500=0.2815, 1000=0.23458 (USD)
P12 = Header 6X2: Conn Unshrouded Header HDR 12 POS 2.54mm Solder ST Top Entry SMD T/R; Manufacturer: Amphenol ICC / FCI; Manufacturer Part Number: 10129383-912002ALF; LatestRevisionDate: 17-Jul-2002; LatestRevisionNote: Re-released for DXP Platform.; Publisher: Altium Limited; Supplier 1: Digi-Key; Supplier Part Number 1: 609-10129383-912002ALFCT-ND; RoHS: No; Category: Connectors; Stock 1: 1060; Pricing 1: 1=0.6, 10=0.52 (USD)
P14 P20 = Header 5X2: Btb Connector, Header, 10POS, 2ROW, 2.54MM;; Manufacturer: Amphenol Communications Solutions; Manufacturer Part Number: 10129383-910002ALF; Supplier 1: Digi-Key; Supplier Part Number 1: 609-10129383-910002ALFCT-ND; RoHS: No; Stock 1: 14112; Pricing 1: 1=0.48, 10=0.422 (USD)
P15 = Header 15X2: Header, 15-Pin, Dual row; Supplier 1: LCSC; Supplier Part Number 1: C2685170
Q1 Q2 = NMOS-2: as Q5 on sheet Shield; Supplier 1: JLCPCB; Supplier Part Number 1: C78284; Manufacturer Part Number 1: BSS138; Value: BSS138
R4-R7 = Res1: as R11 on sheet Shield; Footprint: 0402; Supplier 1: JLCPCB; Supplier Part Number 1: C25744

## Sheet STM32F103RCT6.SchDoc
size A; SheetNumber: 3; SheetTotal: 3
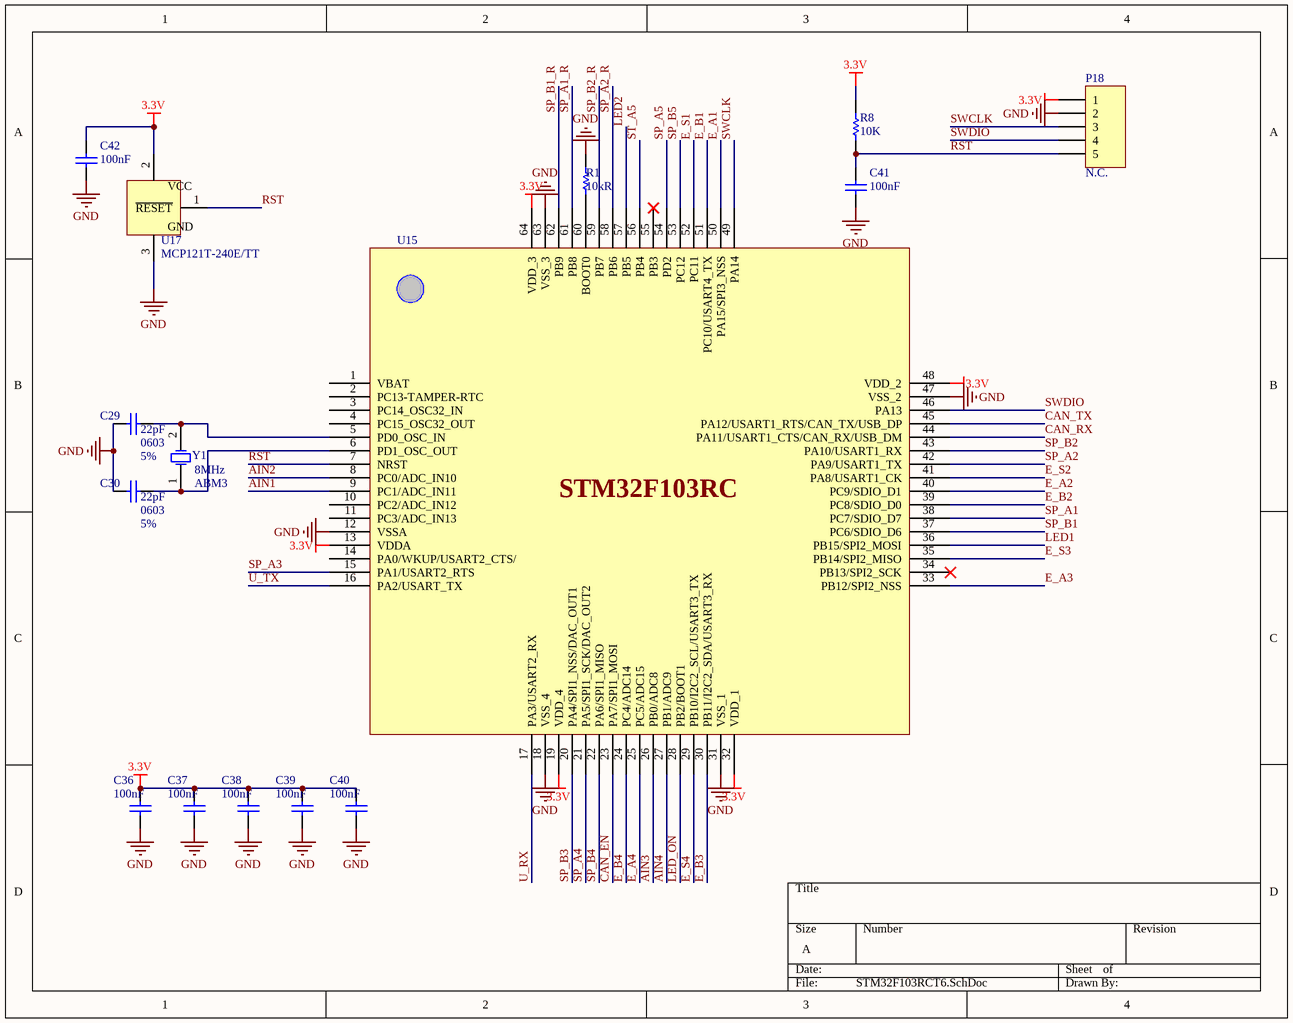
[diagram p2: STM32F103RCT6.SchDoc]

### Parts
C29  value 22pF  Case Code (Imperial): 0603  Tolerance: 5%  [C0603]  (hidden comment: Cap)
C30  value 22pF  Case Code (Imperial): 0603  Tolerance: 5%  [C0603]  (hidden comment: Cap)
C36  100nF  [C0402]
C37  100nF  [C0402]
C38  100nF  [C0402]
C39  100nF  [C0402]
C40  100nF  [C0402]
C41  100nF  [C0402]
C42  100nF  [C0402]
P18  N.C.  [HDR1X5]
R1  10kR  [R0402]
R8  value 10K  [R0402]  (hidden comment: Res1)
U15  STM32F103RC  [LQFP64]
U17  MCP121T-240E/TT  [SOT23-3]
Y1  value 8MHz  [ABM3]  (hidden comment: Crystal Oscillator)

### Nets
3.3V: C36.2 C37.2 C38.2 C39.2 C40.2 C42.2 P18.1 R8.1 U15.13(VDDA) U15.19(VDD_4) U15.32(VDD_1) U15.48(VDD_2) U15.64(VDD_3) U17.2(VCC)
GND: C29.2 C30.2 C36.1 C37.1 C38.1 C39.1 C40.1 C41.1 C42.1 P18.2 R1.2 U15.12(VSSA) U15.18(VSS_4) U15.31(VSS_1) U15.47(VSS_2) U15.63(VSS_3) U17.3(GND)
AIN1: U15.9(PC1/ADC_IN11)
AIN2: U15.8(PC0/ADC_IN10)
AIN3: U15.26(PB0/ADC8)
AIN4: U15.27(PB1/ADC9)
CAN_EN: U15.23(PA7/SPI1_MOSI)
CAN_RX: U15.44(PA11/USART1_CTS/CAN_RX/USB_DM)
CAN_TX: U15.45(PA12/USART1_RTS/CAN_TX/USB_DP)
E_A1: U15.50(PA15/SPI3_NSS)
E_A2: U15.40(PC9/SDIO_D1)
E_A3: U15.33(PB12/SPI2_NSS)
E_A4: U15.25(PC5/ADC15)
E_B1: U15.51(PC10/USART4_TX)
E_B2: U15.39(PC8/SDIO_D0)
E_B3: U15.30(PB11/I2C2_SDA/USART3_RX)
E_B4: U15.24(PC4/ADC14)
E_S1: U15.52(PC11)
E_S2: U15.41(PA8/USART1_CK)
E_S3: U15.35(PB14/SPI2_MISO)
E_S4: U15.29(PB10/I2C2_SCL/USART3_TX)
LED1: U15.36(PB15/SPI2_MOSI)
LED2: U15.57(PB5)
LED_ON: U15.28(PB2/BOOT1)
RST: C41.2 P18.5 R8.2 U15.7(NRST) U17.1(~{RESET})
SP_A1: U15.38(PC7/SDIO_D7)
SP_A1_R: U15.61(PB8)
SP_A2: U15.42(PA9/USART1_TX)
SP_A2_R: U15.58(PB6)
SP_A3: U15.15(PA1/USART2_RTS)
SP_A4: U15.21(PA5/SPI1_SCK/DAC_OUT2)
SP_A5: U15.54(PD2)
SP_B1: U15.37(PC6/SDIO_D6)
SP_B1_R: U15.62(PB9)
SP_B2: U15.43(PA10/USART1_RX)
SP_B2_R: U15.59(PB7)
SP_B3: U15.20(PA4/SPI1_NSS/DAC_OUT1)
SP_B4: U15.22(PA6/SPI1_MISO)
SP_B5: U15.53(PC12)
ST_A5: U15.56(PB4)
SWCLK: P18.3 U15.49(PA14)
SWDIO: P18.4 U15.46(PA13)
U_RX: U15.17(PA3/USART2_RX)
U_TX: U15.16(PA2/USART_TX)
NetC29_1: C29.1 U15.5(PD0_OSC_IN) Y1.2(OSC2)
NetC30_1: C30.1 U15.6(PD1_OSC_OUT) Y1.1(OSC1)
NetR1_1: R1.1 U15.60(BOOT0)

Not connected (* = marked no-connect by the designer): U15 1(VBAT) 2(PC13-TAMPER-RTC) 3(PC14_OSC32_IN) 4(PC15_OSC32_OUT) 10(PC2/ADC_IN12) 11(PC3/ADC_IN13) 14(PA0/WKUP/USART2_CTS/) 34(PB13/SPI2_SCK)* 55(PB3)*

### Library data of the parts
C29 C30 = Cap_0603: CAP CER 22PF 50V C0G/NPO 0603; Manufacturer: Yageo; Manufacturer Part Number: CC0603JRNPO9BN220; Dielectric: C0G; Temperature Coefficient: 30ppm/°C; Insulation Resistance: 10GR; Supplier 1: Digi-Key; Supplier Part Number 1: 311-1062-6-ND; Stock 1: 221499; Pricing 1: 1=0.1, 10=0.044, 100=0.0197, 500=0.0141, 1000=0.01108 (USD); Mount: Surface Mount; Case/Package: 0603; Number of Pins: 2; Case Code (Metric): 1608; Min Operating Temperature: -55°C; Max Operating Temperature: 125°C; Capacitance: 22pF; Voltage Rating: 50V; Voltage Rating (DC): 50V; Packaging: Tape and Reel; Package Quantity: 1; Termination: SMD/SMT; Voltage: 50V; Length: 1.6mm; Height: 0.8mm; Width: 0.031inch; Thickness: 0.035inch; Depth: 0.8mm; Radiation Hardening: No; REACH SVHC: No SVHC; Lead Free: Lead Free; ComponentLink1URL: http://www.farnell.com/datasheets/2213336.pdf?src-supplier=Element14; ComponentLink1Description: http://www.farnell.com/datasheets/2213336.pdf?src-supplier=Element14; ComponentLink2URL: http://www.yageo.com/documents/recent/UPY-GP_NP0_16V-to-50V_16.pdf?src-supplier=Digi-Key; ComponentLink2Description: http://www.yageo.com/documents/recent/UPY-GP_NP0_16V-to-50V_16.pdf?src-supplier=Digi-Key; ComponentLink3URL: http://www.farnell.com/datasheets/1443161.pdf?src-supplier=Element14; ComponentLink3Description: http://www.farnell.com/datasheets/1443161.pdf?src-supplier=Element14; ComponentLink4URL: http://www.yageo.com/documents/recent/UPY-GP_NP0_16V-to-50V_8.pdf?src-supplier=Avnet; ComponentLink4Description: http://www.yageo.com/documents/recent/UPY-GP_NP0_16V-to-50V_8.pdf?src-supplier=Avnet; ComponentLink5URL: http://www.yageo.com/documents/recent/UPY-GP_NP0_16V-to-50V_8.pdf?src-supplier=Avnet+Europe; ComponentLink5Description: http://www.yageo.com/documents/recent/UPY-GP_NP0_16V-to-50V_8.pdf?src-supplier=Avnet+Europe
C36-C42 = Cap: as C34 on sheet Shield; Supplier 1: Digi-Key; Supplier Part Number 1: 399-C0402C104K4RAC7867CT-ND; RoHS: Yes; Category: Ceramic Capacitors; Stock 1: 4665619; Pricing 1: 1=0.1, 10=0.032, 50=0.0172, 100=0.0141, 500=0.01008, 1000=0.00792, 2500=0.0072, 5000=0.00662 (USD); Case/Package: 0402; Number of Pins: 2; Case Code (Metric): 1005; Case Code (Imperial): 0402; Dielectric Material: Ceramic; Min Operating Temperature: -55°C; Max Operating Temperature: 125°C; Capacitance: 100nF; Tolerance: 10%; Voltage Rating: 16V; Packaging: Tape and Reel; Series: C; Dielectric: X7R; Voltage: 16V; Termination: SMD/SMT; Length: 1mm; Height: 0.5mm; Depth: 0.5mm; Reach SVHC Compliant: No
P18 = Header 5: Header, 5-Pin
R1 = Res1: SMD Chip Resistor, 10 kOhm, ± 5%, 63 mW, 0402 [1005 Metric], Thick Film, General Purpose; Manufacturer: Yageo; Manufacturer Part Number: RC0402JR-0710KL; Power Rating: 62.5mW; Voltage Rating: 50V; Temperature Coefficient: 100ppm/°C; Max Power Dissipation: 63mW; ComponentLink1URL: https://datasheet.ciiva.com/7660/38590-7660789.pdf?src-supplier=Element14; ComponentLink1Description: https://datasheet.ciiva.com/7660/38590-7660789.pdf?src-supplier=Element14; ComponentLink2URL: https://datasheet.ciiva.com/46440/1868787-46440891.pdf?src-supplier=Element14; ComponentLink2Description: https://datasheet.ciiva.com/46440/1868787-46440891.pdf?src-supplier=Element14; ComponentLink3URL: https://datasheet.ciiva.com/7746/1738695-7746239.pdf?src-supplier=Element14; ComponentLink3Description: https://datasheet.ciiva.com/7746/1738695-7746239.pdf?src-supplier=Element14; ComponentLink4URL: https://datasheet.ciiva.com/15189/getdatasheetpartid-409289-15189591.pdf?src-supplier=Verical; ComponentLink4Description: https://datasheet.ciiva.com/15189/getdatasheetpartid-409289-15189591.pdf?src-supplier=Verical; Supplier 1: Digi-Key; Supplier Part Number 1: 311-10KJRCT-ND; RoHS: Yes; Category: Chip SMD Resistors; Stock 1: 36550952; Pricing 1: 1=0.1, 10=0.018, 50=0.0098, 100=0.0079, 500=0.00502, 1000=0.00422, 5000=0.00292 (USD); Case/Package: 0402; Case Code (Metric): 1005; Case Code (Imperial): 0402; Size Code: 0402; Min Operating Temperature: -55°C; Max Operating Temperature: 155°C; Packaging: Tape and Reel; Resistance: 10kR; Tolerance: 5%; Package Quantity: 1; Resistor Type: Thick Film; Number of Terminations: 2; Termination: SMD/SMT; Features: Moisture Resistant; Series: RC; Resistance Tolerance: 5%; Voltage Rating (AC): 50V; Construction: Rectangular; Length: 0.039inch; Width: 0.02inch; Height: 0.016inch; Depth: 0.5mm; Lead Free: Lead Free; RoHS Compliant: Yes; Reach SVHC Compliant: Unknown; Military Standard: Not
R8 = Res1: as R11 on sheet Shield; Footprint: 0402; Supplier 1: JLCPCB; Supplier Part Number 1: C25744
U15 = STM32F103RC: MCU 32-bit STM32F1 ARM Cortex M3 RISC 256KB Flash 2.5V/3.3V 64-Pin LQFP Tray; Manufacturer: STMicroelectronics; Manufacturer Part Number: STM32F103RCT6; Interface: I2C,SPI,USB,CAN,USART; RAM Size: 48KB; Max Supply Voltage: 3.6V; Number of I/Os: 51; Number of Timers/Counters: 8; Min Supply Voltage: 2V; Data Bus Width: 32b; Max Frequency: 72MHz; Number of ADC Channels: 16; Supplier 1: LCSC; Supplier Part Number 1: C8323; RoHS: Yes; Category: Microcontrollers; Stock 1: 874; Pricing 1: 1=2.3912, 10=2.0905, 30=1.8789, 100=1.6848, 500=1.5957, 1000=1.5607 (USD); Case/Package: LQFP; Number of Pins: 64; Weight: 0.012088oz; Min Operating Temperature: -40°C; Max Operating Temperature: 85°C; Package Quantity: 960; Packaging: Tray; Memory Type: FLASH; Memory Size: 256KB; Core Architecture: ARM; Series: STM32F103RC; Length: 10mm; Width: 10mm; Height: 1.4mm; Lead Free: Lead Free; RoHS Compliant: Yes; ComponentLink1URL: https://datasheet.ciiva.com/4845/cd00191185-4845648.pdf?src-supplier=Mouser; ComponentLink1Description: https://datasheet.ciiva.com/4845/cd00191185-4845648.pdf?src-supplier=Mouser; ComponentLink2URL: https://datasheet.ciiva.com/8054/1831497-8054949.pdf?src-supplier=Element14; ComponentLink2Description: https://datasheet.ciiva.com/8054/1831497-8054949.pdf?src-supplier=Element14; ComponentLink3URL: https://datasheet.ciiva.com/5752/cd00191185-5752853.pdf?src-supplier=Farnell; ComponentLink3Description: https://datasheet.ciiva.com/5752/cd00191185-5752853.pdf?src-supplier=Farnell; ComponentLink4URL: https://datasheet.ciiva.com/9224/cd00191185-9224408.pdf?src-supplier=Avnet; ComponentLink4Description: https://datasheet.ciiva.com/9224/cd00191185-9224408.pdf?src-supplier=Avnet; ComponentLink5URL: https://datasheet.ciiva.com/16382/cd00191185-16382444.pdf?src-supplier=Future+Electronics; ComponentLink5Description: https://datasheet.ciiva.com/16382/cd00191185-16382444.pdf?src-supplier=Future+Electronics
U17 = MCP121: IC SUPERVISOR 1 CHANNEL SOT23-3; Manufacturer: Microchip; Min Supply Voltage: 1V; Max Supply Voltage: 5.5V; Nominal Supply Current: 20uA; Number of Voltages Monitored: 1; Reset: Active Low; Reset Timeout: 80ms; Threshold Voltage: 2.32V; Overvoltage Threshold: 2.355V; Undervoltage Threshold: 2.285V; Watchdog Timer: No; Quiescent Current: 1uA; Supplier 1: Digi-Key; Supplier Part Number 1: MCP121T-240E/TTCT-ND; Manufacturer Part Number: MCP121T-240E/TT; Stock 1: 2743; Pricing 1: 1=0.53, 25=0.45, 100=0.4 (USD); Mount: Surface Mount; Case/Package: SOT-23-3; Number of Pins: 3; Min Operating Temperature: -40°C; Max Operating Temperature: 125°C; Packaging: Tape and Reel; Type: Simple Reset/Power-On Reset; Package Quantity: 1; Operating Supply Current: 20uA; Max Supply Current: 20uA; Number of Elements: 1; Min Reset Threshold Voltage: 2.285V; Max Reset Threshold Voltage: 2.355V; Length: 3.04mm; Height: 1.02mm; Width: 1.4mm; Radiation Hardening: No; REACH SVHC: No SVHC; Lead Free: Lead Free; ComponentLink1URL: http://www.microchip.com/mymicrochip/filehandler.aspx?ddocname=en023833&src-supplier=Digi-Key; ComponentLink1Description: http://www.microchip.com/mymicrochip/filehandler.aspx?ddocname=en023833&src-supplier=Digi-Key; ComponentLink2URL: http://www.microchip.com/mymicrochip/filehandler.aspx?ddocname=en022913&src-supplier=Digi-Key; ComponentLink2Description: http://www.microchip.com/mymicrochip/filehandler.aspx?ddocname=en022913&src-supplier=Digi-Key; ComponentLink3URL: http://ww1.microchip.com/downloads/jp/DeviceDoc/21906b.pdf?src-supplier=Avnet; ComponentLink3Description: http://ww1.microchip.com/downloads/jp/DeviceDoc/21906b.pdf?src-supplier=Avnet; ComponentLink4URL: http://www.microchip.com/mymicrochip/filehandler.aspx?ddocname=en022913&src-supplier=Future+Electronics; ComponentLink4Description: http://www.microchip.com/mymicrochip/filehandler.aspx?ddocname=en022913&src-supplier=Future+Electronics; ComponentLink5URL: http://ww1.microchip.com/downloads/jp/DeviceDoc/21906b.pdf?src-supplier=Avnet+Europe; ComponentLink5Description: http://ww1.microchip.com/downloads/jp/DeviceDoc/21906b.pdf?src-supplier=Avnet+Europe; ComponentLink6URL: http://www.farnell.com/datasheets/1787125.pdf?src-supplier=Element14; ComponentLink6Description: http://www.farnell.com/datasheets/1787125.pdf?src-supplier=Element14; ComponentLink7URL: http://www.produktinfo.conrad.com/datenblaetter/1000000-1099999/001085773-da-01-en-IC_SUPERVISO_MCP121T_240E_TT_SOT_23B_MCP.pdf?src-supplier=Conrad; ComponentLink7Description: http://www.produktinfo.conrad.com/datenblaetter/1000000-1099999/001085773-da-01-en-IC_SUPERVISO_MCP121T_240E_TT_SOT_23B_MCP.pdf?src-supplier=Conrad
Y1 = XTAL: CRYSTAL 8.0000MHZ 12PF SMD; Manufacturer: Kyocera AVX; Manufacturer Part Number: CX5032GB08000H0HPQZ1; ESR (Equivalent Series Resistance): 300R; Frequency Stability: 30ppm; Frequency Tolerance: 20ppm; Supplier 1: Digi-Key; Supplier Part Number 1: 1253-1373-6-ND; Stock 1: 10035; Pricing 1: 1=0.8, 10=0.708, 50=0.6622, 100=0.5852, 500=0.5544 (USD); Mount: Surface Mount; Case/Package: ABM3; Weight: 0.001764oz; Min Operating Temperature: -40°C; Max Operating Temperature: 85°C; Packaging: Tape and Reel; Frequency: 8MHz; Load Capacitance: 12pF; Termination: SMD/SMT; Tolerance: 20ppm; Package Quantity: 1000; Length: 0.197inch; Height: 0.043inch; Width: 0.126inch; ComponentLink1URL: https://media.digikey.com/pdf/Data%20Sheets/AVX%20PDFs/CX5032GB0yyyyyH0HPQZ1_Series_Spec.pdf?src-supplier=Digi-Key; ComponentLink1Description: https://media.digikey.com/pdf/Data%20Sheets/AVX%20PDFs/CX5032GB0yyyyyH0HPQZ1_Series_Spec.pdf?src-supplier=Digi-Key; ComponentLink2URL: http://www.kyocera-crystal.jp/eng/wp-content/uploads/2015/10/cx5032gb_e.pdf?src-supplier=Avnet+Asia; ComponentLink2Description: http://www.kyocera-crystal.jp/eng/wp-content/uploads/2015/10/cx5032gb_e.pdf?src-supplier=Avnet+Asia; ComponentLink3URL: http://www.mouser.com/ds/2/40/cx5032gb_e-934943.pdf?src-supplier=Mouser; ComponentLink3Description: http://www.mouser.com/ds/2/40/cx5032gb_e-934943.pdf?src-supplier=Mouser

## Nets that join several sheets
3.3V: Shield (40 pins), SheildLattePanda (Q1.1 Q2.1 R4.1 R6.1), STM32F103RCT6 (14 pins)
5V: Shield (7 pins), SheildLattePanda (P14.1 P14.3 R5.1 R7.1)
12V: Shield (P13.1 P16.1), SheildLattePanda (P12.1 P12.3)
GND: Shield (51 pins), SheildLattePanda (16 pins), STM32F103RCT6 (17 pins)
AIN1: Shield (P9.2), STM32F103RCT6 (U15.9)
AIN2: Shield (P11.2), STM32F103RCT6 (U15.8)
AIN3: Shield (P8.2), STM32F103RCT6 (U15.26)
AIN4: Shield (P10.2), STM32F103RCT6 (U15.27)
CAN_EN: Shield (U16.8), STM32F103RCT6 (U15.23)
CAN_RX: Shield (U16.4), STM32F103RCT6 (U15.44)
CAN_TX: Shield (U16.1), STM32F103RCT6 (U15.45)
E_A1: Shield (C6.1 U7.7), STM32F103RCT6 (U15.50)
E_A2: Shield (C2.1 U5.7), STM32F103RCT6 (U15.40)
E_A3: Shield (C21.1 U12.8), STM32F103RCT6 (U15.33)
E_A4: Shield (C18.1 U11.7), STM32F103RCT6 (U15.25)
E_B1: Shield (C7.1 U7.6), STM32F103RCT6 (U15.51)
E_B2: Shield (C1.1 U5.8), STM32F103RCT6 (U15.39)
E_B3: Shield (C20.1 U11.5), STM32F103RCT6 (U15.30)
E_B4: Shield (C17.1 U11.8), STM32F103RCT6 (U15.24)
E_S1: Shield (C8.1 U7.5), STM32F103RCT6 (U15.52)
E_S2: Shield (C3.1 U5.6), STM32F103RCT6 (U15.41)
E_S3: Shield (C22.1 U12.7), STM32F103RCT6 (U15.35)
E_S4: Shield (C19.1 U11.6), STM32F103RCT6 (U15.29)
LED1: Shield (Q5.2 R11.2), STM32F103RCT6 (U15.36)
LED2: Shield (Q6.2 R13.2), STM32F103RCT6 (U15.57)
LED_ON: Shield (Q4.1), STM32F103RCT6 (U15.28)
SP_A1: Shield (C24.1 U12.5), STM32F103RCT6 (U15.38)
SP_A1_R: Shield (C15.1 U6.7), STM32F103RCT6 (U15.61)
SP_A2: Shield (C4.1 U5.5), STM32F103RCT6 (U15.42)
SP_A2_R: Shield (C13.1 U6.5), STM32F103RCT6 (U15.58)
SP_A3: Shield (C25.1 U14.5), STM32F103RCT6 (U15.15)
SP_A4: Shield (C27.1 U14.7), STM32F103RCT6 (U15.21)
SP_A5: Shield (C10.1 U8.6), STM32F103RCT6 (U15.54)
SP_B1: Shield (C23.1 U12.6), STM32F103RCT6 (U15.37)
SP_B1_R: Shield (C16.1 U6.8), STM32F103RCT6 (U15.62)
SP_B2: Shield (C5.1 U7.8), STM32F103RCT6 (U15.43)
SP_B2_R: Shield (C14.1 U6.6), STM32F103RCT6 (U15.59)
SP_B3: Shield (C26.1 U14.6), STM32F103RCT6 (U15.20)
SP_B4: Shield (C28.1 U14.8), STM32F103RCT6 (U15.22)
SP_B5: Shield (C9.1 U8.5), STM32F103RCT6 (U15.53)
ST_A5: Shield (C11.1 U8.7), STM32F103RCT6 (U15.56)
U_RX: SheildLattePanda (Q1.2 R4.2), STM32F103RCT6 (U15.17)
U_TX: SheildLattePanda (Q2.2 R6.2), STM32F103RCT6 (U15.16)